# EAGLE design Eagle_PowerBoard (EAGLE 5.06)
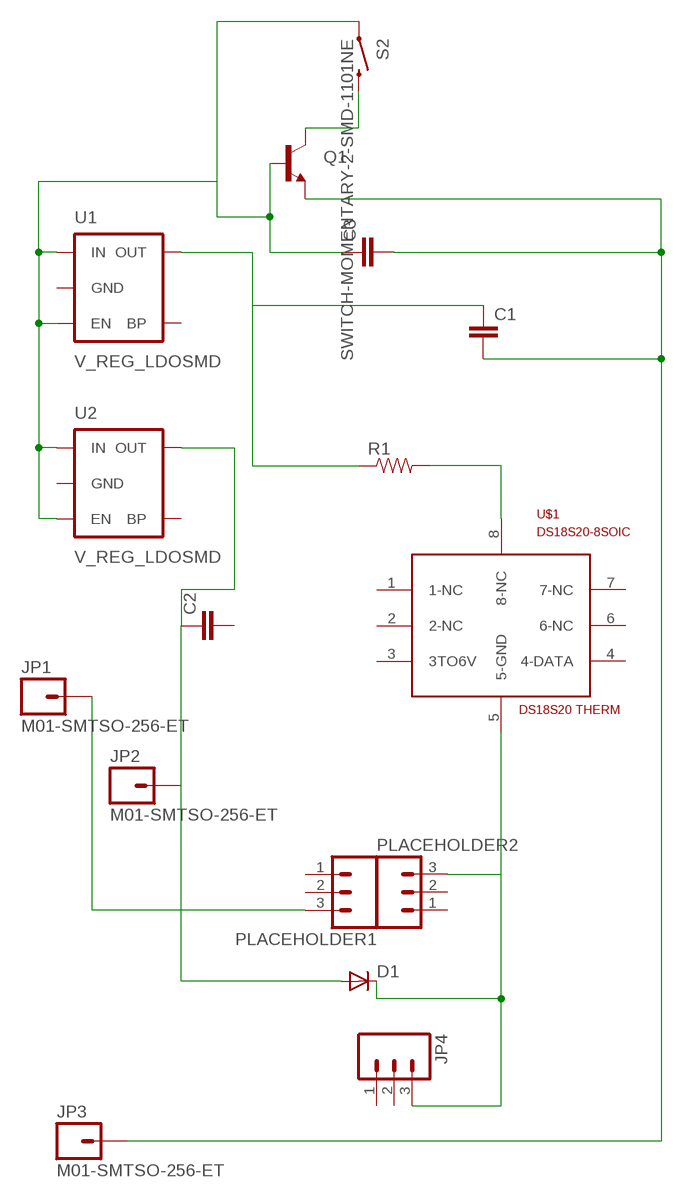
[diagram p0: schematic, sheet 1]

## Parts
C1  CAP0805  [0805]
C2  CAP0805  [0805]
C3  CAP0805  [0805]
D1  DIODE1N4148  [DIODE-1N4148]
JP1  M01-SMTSO-256-ET  [SMTSO-256-ET]
JP2  M01-SMTSO-256-ET  [SMTSO-256-ET]
JP3  M01-SMTSO-256-ET  [SMTSO-256-ET]
JP4  M03LOCK_LONGPADS  [1X03_LOCK_LONGPADS]
PLACEHOLDER1  M03LOCK_LONGPADS  [1X03_LOCK_LONGPADS]
PLACEHOLDER2  M03LOCK_LONGPADS  [1X03_LOCK_LONGPADS]
Q1  TRANSISTOR_NPNSOT23-3  [SOT23-3]
R1  RESISTOR  [0805]
S2  SWITCH-MOMENTARY-2-SMD-1101NE  [TACTILE-SWITCH-1101NE]
U1  V_REG_LDOSMD  [SOT23-5]
U2  V_REG_LDOSMD  [SOT23-5]
U$1  DS18S20-8SOIC  [SOIC8-NARROW-150MIL]

## Nets
5V: C3.1 Q1.1(B) S2.P$1 U1.1(IN) U1.3(EN) U2.1(IN) U2.3(EN)
N$1: Q1.3(C) S2.P$2
N$3: C1.2 C3.2 JP3.P$1 Q1.2(E)
N$4: C1.1 R1.1 U1.5(OUT)
N$5: R1.2 U$1.8(8-NC)
N$6: D1.C JP4.3 PLACEHOLDER2.3 U$1.5(5-GND)
N$7: JP1.P$1 PLACEHOLDER1.3
N$8: C2.1 D1.A JP2.P$1 U2.5(OUT)
Unconnected: C2.2 JP4.1 JP4.2 PLACEHOLDER1.1 PLACEHOLDER1.2 PLACEHOLDER2.1 PLACEHOLDER2.2 U1.2(GND) U1.4(BP) U2.2(GND) U2.4(BP) U$1.1(1-NC) U$1.2(2-NC) U$1.3(3TO6V) U$1.4(4-DATA) U$1.6(6-NC) U$1.7(7-NC)

## Library data of the parts
C1-C3 = SparkFun:CAP: Capacitor Standard 0603 ceramic capacitor, and 0.1" leaded capacitor.
D1 = SparkFun:DIODE: Diode These are standard reverse protection diodes and small signal diodes. SMA package can handle up to about 1A. SOD-323 can handle about 200mA. What the SOD-323 package when ordering, there are some mfgs out there that are 5-pin packages.
JP1-JP3 = SparkFun:M01: Header 1 Standard 1-pin 0.1" header. Use with straight break away headers (SKU : PRT-00116), right angle break away headers (PRT-00553), swiss pins (PRT-00743), machine pins (PRT-00117), and female headers (PRT-00115).
JP4 PLACEHOLDER1 PLACEHOLDER2 = SparkFun:M03: Header 3 Standard 3-pin 0.1" header. Use with straight break away headers (SKU : PRT-00116), right angle break away headers (PRT-00553), swiss pins (PRT-00743), machine pins (PRT-00117), and female headers (PRT-00115). Molex polarized connector foot print use with SKU : PRT-08232 with associated crimp pins and housings.
Q1 = SparkFun:TRANSISTOR_NPN: Transistor NPN BJT configuration in SOT23 package. MMBT2222 is the common NPN we use. Double check BCE configuration again layout.
R1 = SparkFun:RESISTOR: Resistor Basic schematic elements and footprints for 0603, 1206, and PTH 1/10th watt (small) resistors.
S2 = SparkFun:SWITCH-MOMENTARY-2
U1 U2 = SparkFun:V_REG_LDO: Voltage Regulator LDO Standard 150mA LDO voltage regulator in SOT-23 layout. Micrel part MIC5205. BP (by-pass) pin is used to lower output noise with 470pF cap.
U$1 = CindysStuff:DS18S20-8SOIC

## Board
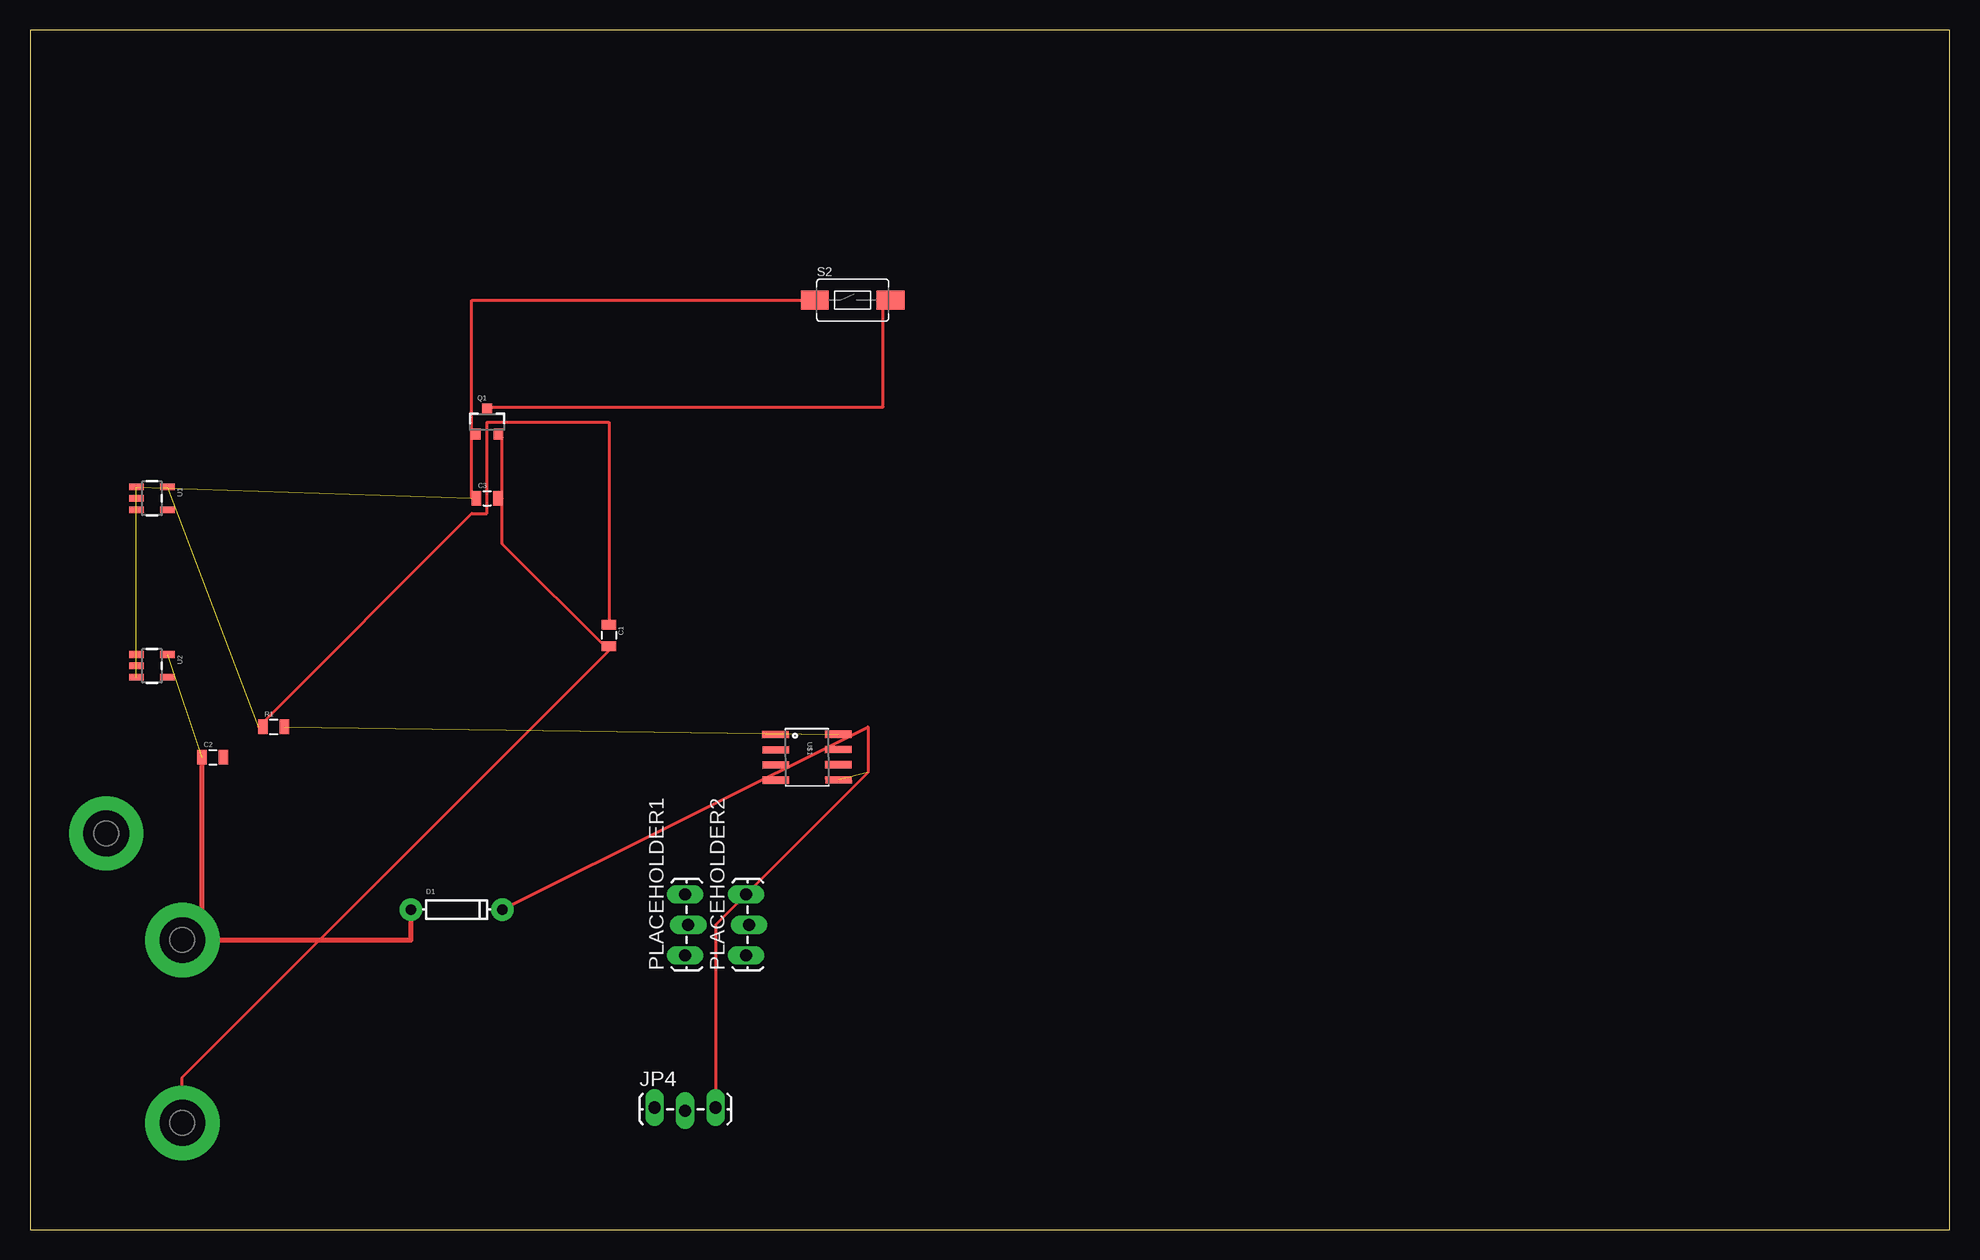
[diagram p1: board, top side]
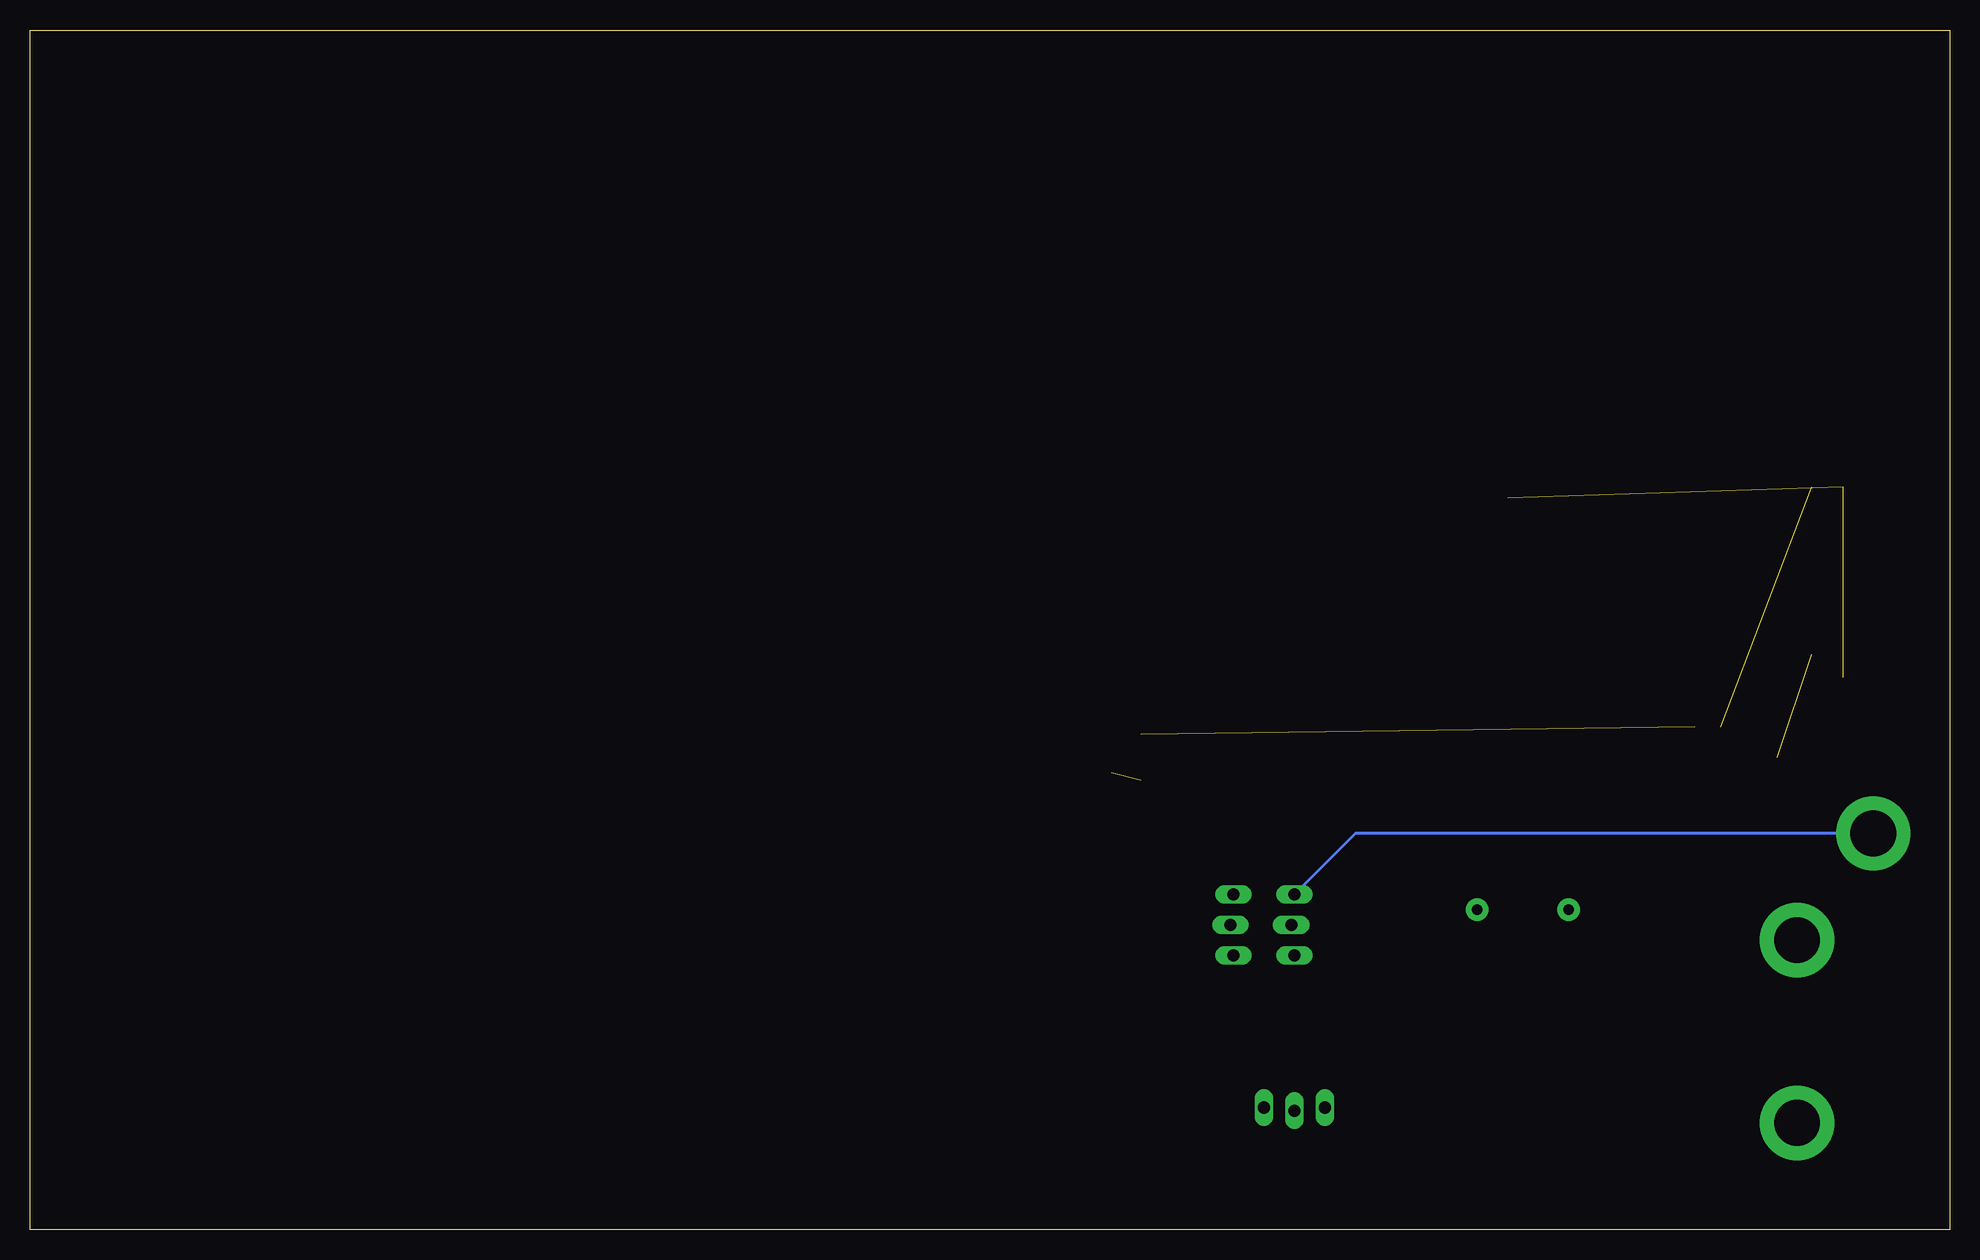
[diagram p2: board, bottom side, seen from below]

Size 160 x 100 mm. Coordinates in mm from the lower left corner, seen from the top.
Outline: 0,0 160,0 160,100 0,100 0,0
Copper layers (1*16): Top 0.035mm / dielectric 1.5mm / Bottom 0.035mm
Design rules "default": minimum track width 10mil, minimum drill 24mil, track to track 8mil, track to pad 8mil, pad to pad 8mil, via to via 8mil, smd to smd 8mil, copper to edge 40mil, drill to drill 8mil, minimum pad ring 10mil, minimum via ring 8mil, stop-mask expansion 4mil, vias tented up to drill 0mil, thermal gap 10mil

### Footprints (pad centres in the part's own frame; a part is rotated, then mirrored left to right if it is on the bottom)
0805 = smd 0.8 x 1.2: 1 -0.9,0; 2 0.9,0
DIODE-1N4148 = drill 0.9 pad 1.88 round: A -3.81,0; C 3.81,0
SMTSO-256-ET = drill 3.81 pad 6.198 round: P$1 0,0
1X03_LOCK_LONGPADS = drill 1.016 long: 1 0,0; 2 2.54,-0.254; 3 5.08,0
SOT23-3 = smd 0.8 x 0.9: 1 -0.95,-1; 2 0.95,-1; 3 0,1.1
TACTILE-SWITCH-1101NE = smd 2.3 x 1.6: P$1 -3.15,0; P$2 3.15,0
SOT23-5 = smd 0.55 x 1.2: 1 -0.95,-1.3; 2 0,-1.3; 3 0.95,-1.3; 4 0.95,1.3; 5 -0.95,1.3
SOIC8-NARROW-150MIL = smd 0.61 x 2.21: 1 -1.905,-2.616; 2 -0.635,-2.616; 3 0.635,-2.616; 4 1.905,-2.616; 5 1.905,2.616; 6 0.635,2.616; 7 -0.635,2.616; 8 -1.905,2.616

### Placement (x,y rotation side)
C1  48.26,49.53 270 top
C2  15.24,39.37 0 top
C3  38.1,60.96 0 top
D1  35.56,26.67 0 top
JP1  6.35,33.02 0 top
JP2  12.7,24.13 0 top
JP3  12.7,8.89 0 top
JP4  52.07,10.16 0 top
PLACEHOLDER1  54.61,22.86 90 top
PLACEHOLDER2  59.69,22.86 90 top
Q1  38.1,67.31 0 top
R1  20.32,41.91 0 top
S2  68.58,77.47 0 top
U1  10.16,60.96 270 top
U2  10.16,46.99 270 top
U$1  64.77,39.37 270.3 top

### Tracks (layer width: path | path; a pad name or v marks a point on that pad's centre or on a via)
5V  (4 unrouted)
  Top 0.254: 36.83,66.04 36.83,60.96 C3.1 | 36.83,66.04 36.83,77.47 S2.P$1 | 36.83,66.04 Q1.1
N$1
  Top 0.254: Q1.3 38.1,68.58 71.12,68.58 71.12,77.47 S2.P$2
N$3
  Top 0.254: 39.37,60.96 39.37,66.04 Q1.2 | 48.26,48.26 39.37,57.15 39.37,60.96 | 39.37,60.96 C3.2 | 48.26,48.26 12.7,12.7 JP3.P$1 | 48.26,48.26 C1.2
N$4  (1 unrouted)
  Top 0.254: R1.1 19.05,41.91 36.83,59.69 38.1,59.69 38.1,67.31 48.26,67.31 C1.1
N$5  (1 unrouted)
N$6  (1 unrouted)
  Top 0.254: JP4.3 57.15,25.4 PLACEHOLDER2.3 69.85,38.1 69.85,41.91 D1.C
N$7
  Bottom 0.254: PLACEHOLDER1.3 49.53,33.02 JP1.P$1
N$8  (1 unrouted)
  Top 0.406: C2.1 14.34,24.13 JP2.P$1 31.75,24.13 D1.A